# Altium project adapter-50-100mil-x4.PrjPcb
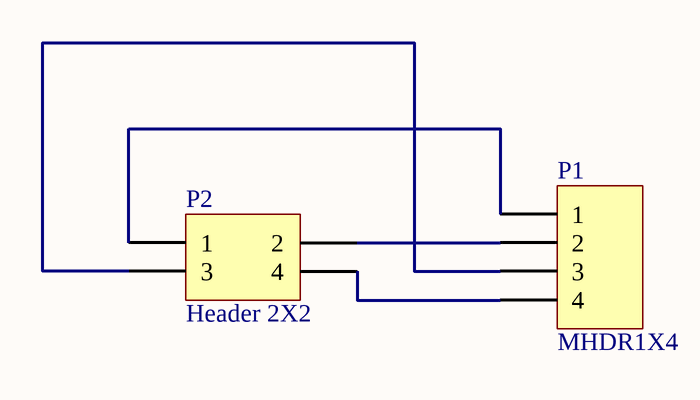
[diagram p0: adapter-50-100mil-x4.SchDoc]
1 sheet, 2 parts. Net scope: global (net labels, ports and power ports of the same name join across sheets).
Board file: adapter-50-100mil-x4.PcbDoc

## Sheet adapter-50-100mil-x4.SchDoc
size A

### Parts
P1  MHDR1X4  [MHDR1X4]
P2  Header 2X2  [HDR2X2]

### Nets
NetP1_1: P1.1 P2.1
NetP1_2: P1.2 P2.2
NetP1_3: P1.3 P2.3
NetP1_4: P1.4 P2.4

### Library data of the parts
P1 = MHDR1X4: Header, 4-Pin; LatestRevisionDate: 17-Jul-2002; LatestRevisionNote: Re-released for DXP Platform.; Publisher: Altium Limited
P2 = Header 2X2: Header, 2-Pin, Dual row; LatestRevisionDate: 17-Jul-2002; LatestRevisionNote: Re-released for DXP Platform.; Publisher: Altium Limited